# Altium schematic sheet Peak Detector.SchDoc
size A; Organization: Altium Limited; Address1: L3, 12a Rodborough Rd; Address2: Frenchs Forest; Address3: NSW; Address4: Australia 2086; DocumentNumber: 2; SheetNumber: 2; SheetTotal: 3
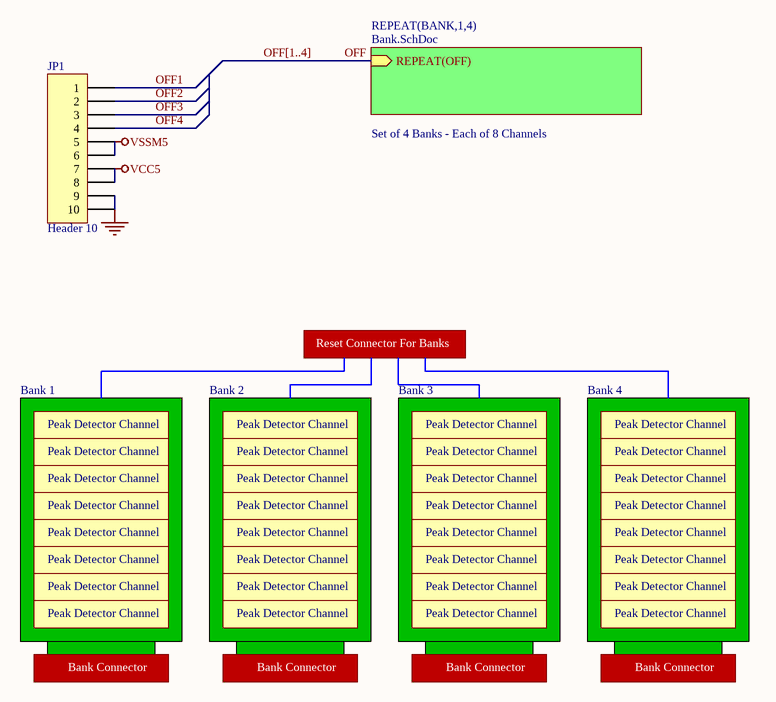
[diagram p0: Peak Detector.SchDoc]

## Parts
JP1  Header 10  [HDR1X10]

## Sub-sheets
REPEAT(BANK,1,4) = Bank.SchDoc: REPEAT(OFF) (in)  | Description: Set of 4 Banks - Each of 8 Channels

## Nets
GND: JP1.9 JP1.10
VCC5: JP1.7 JP1.8
VSSM5: JP1.5 JP1.6
OFF: sheet REPEAT(BANK,1,4)/REPEAT(OFF)
OFF1: JP1.1
OFF2: JP1.2
OFF3: JP1.3
OFF4: JP1.4

## Buses and harness runs
bus OFF[1..4]

## Notes on the sheet
- Reset Connector For Banks
- Bank 1
- Peak Detector Channel
- Bank 2
- Bank 3
- Bank 4
- Bank Connector
- Title
- Size:
- Date:
- A
- Number:
- Time:
- Revision:
- Sheet
- of
- File:

## Library data of the parts
JP1 = Header 10: Header, 10-Pin; Manufacturer: Generic Components; Class: Connector